# Altium project DWDM蝶形激光管驱动器.PrjPcb
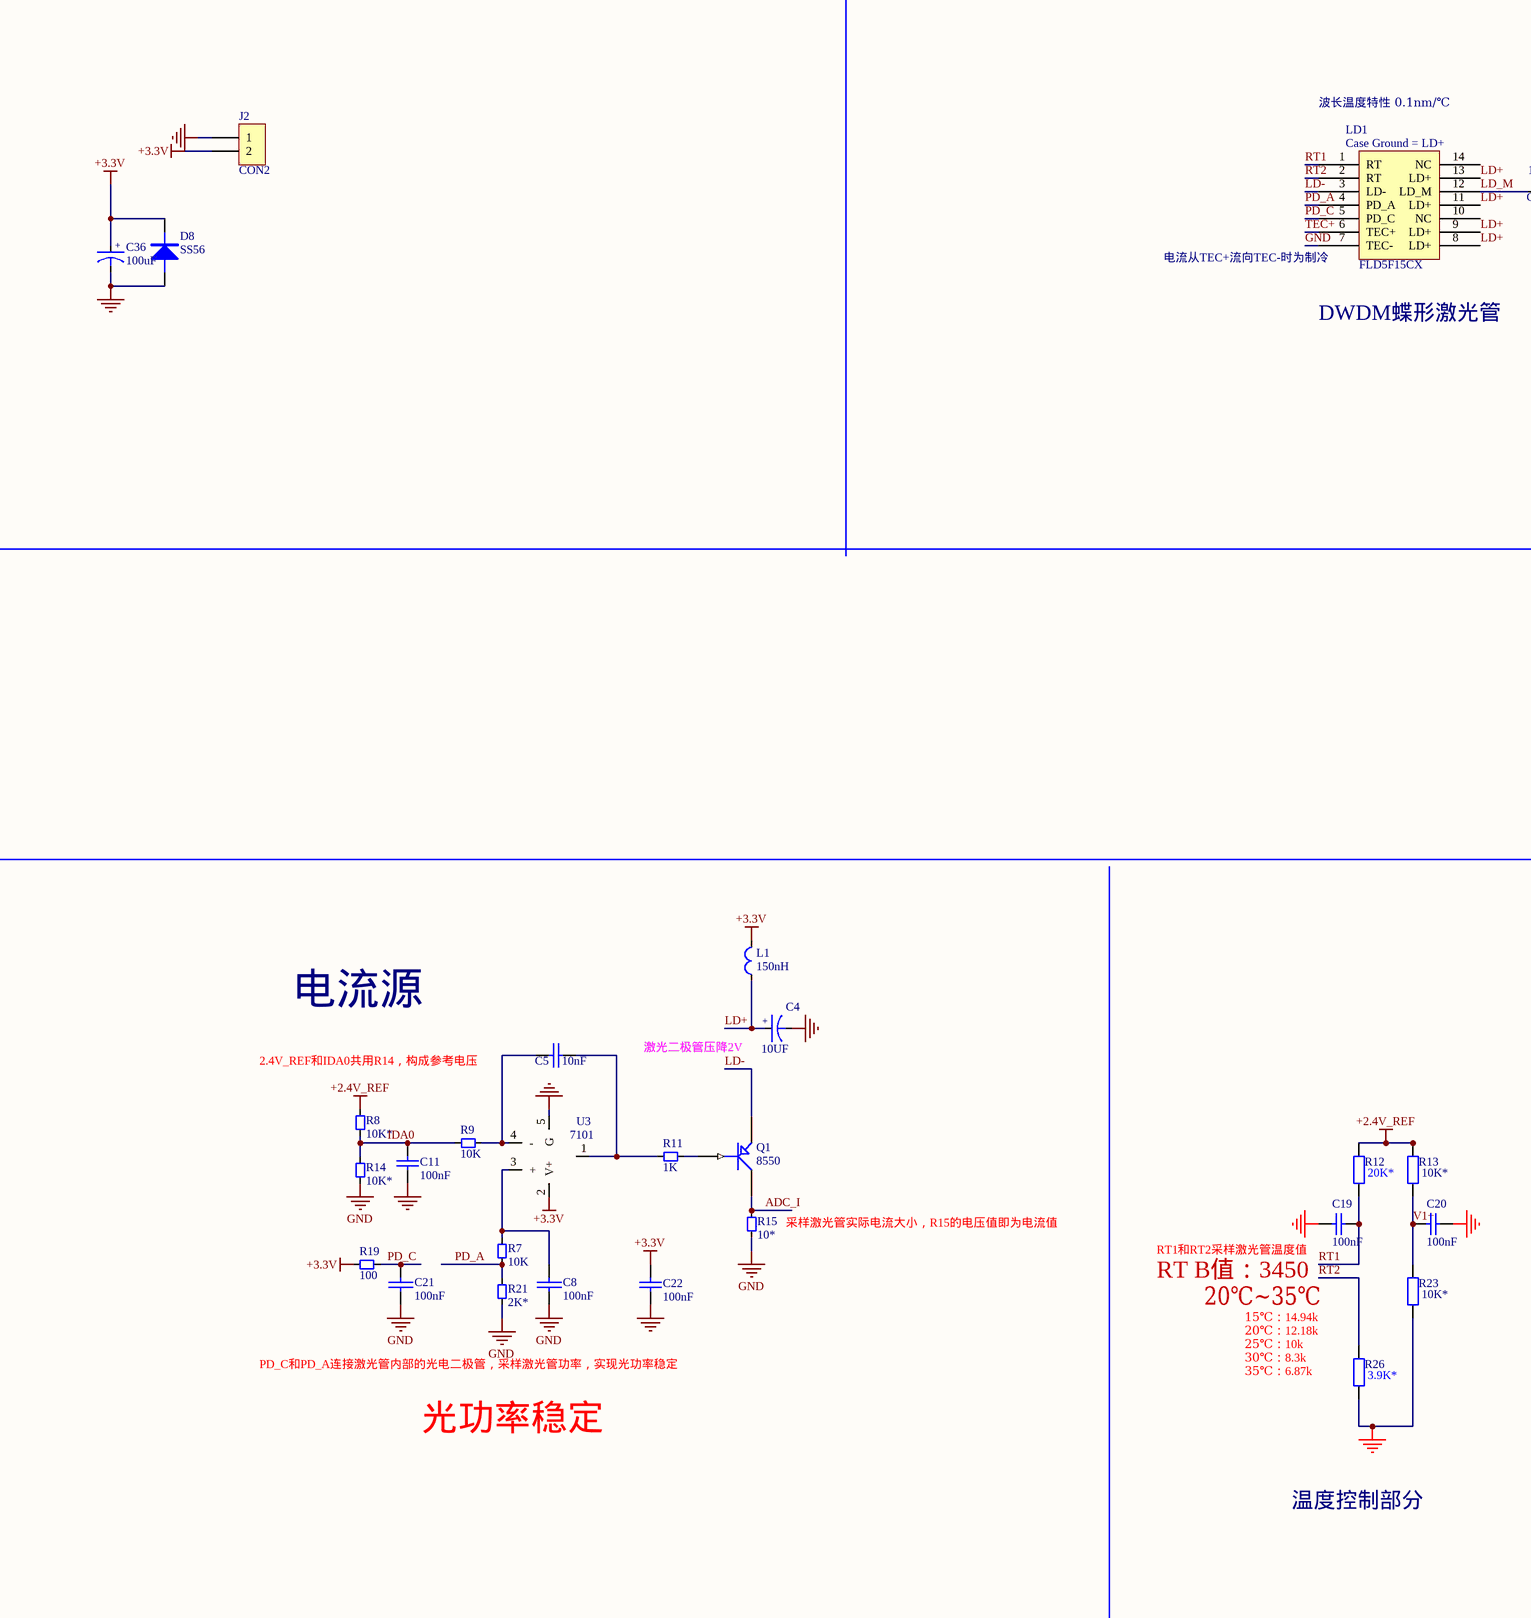
[diagram p0: DWDM蝶形激光管驱动器-线性.SchDoc, left]
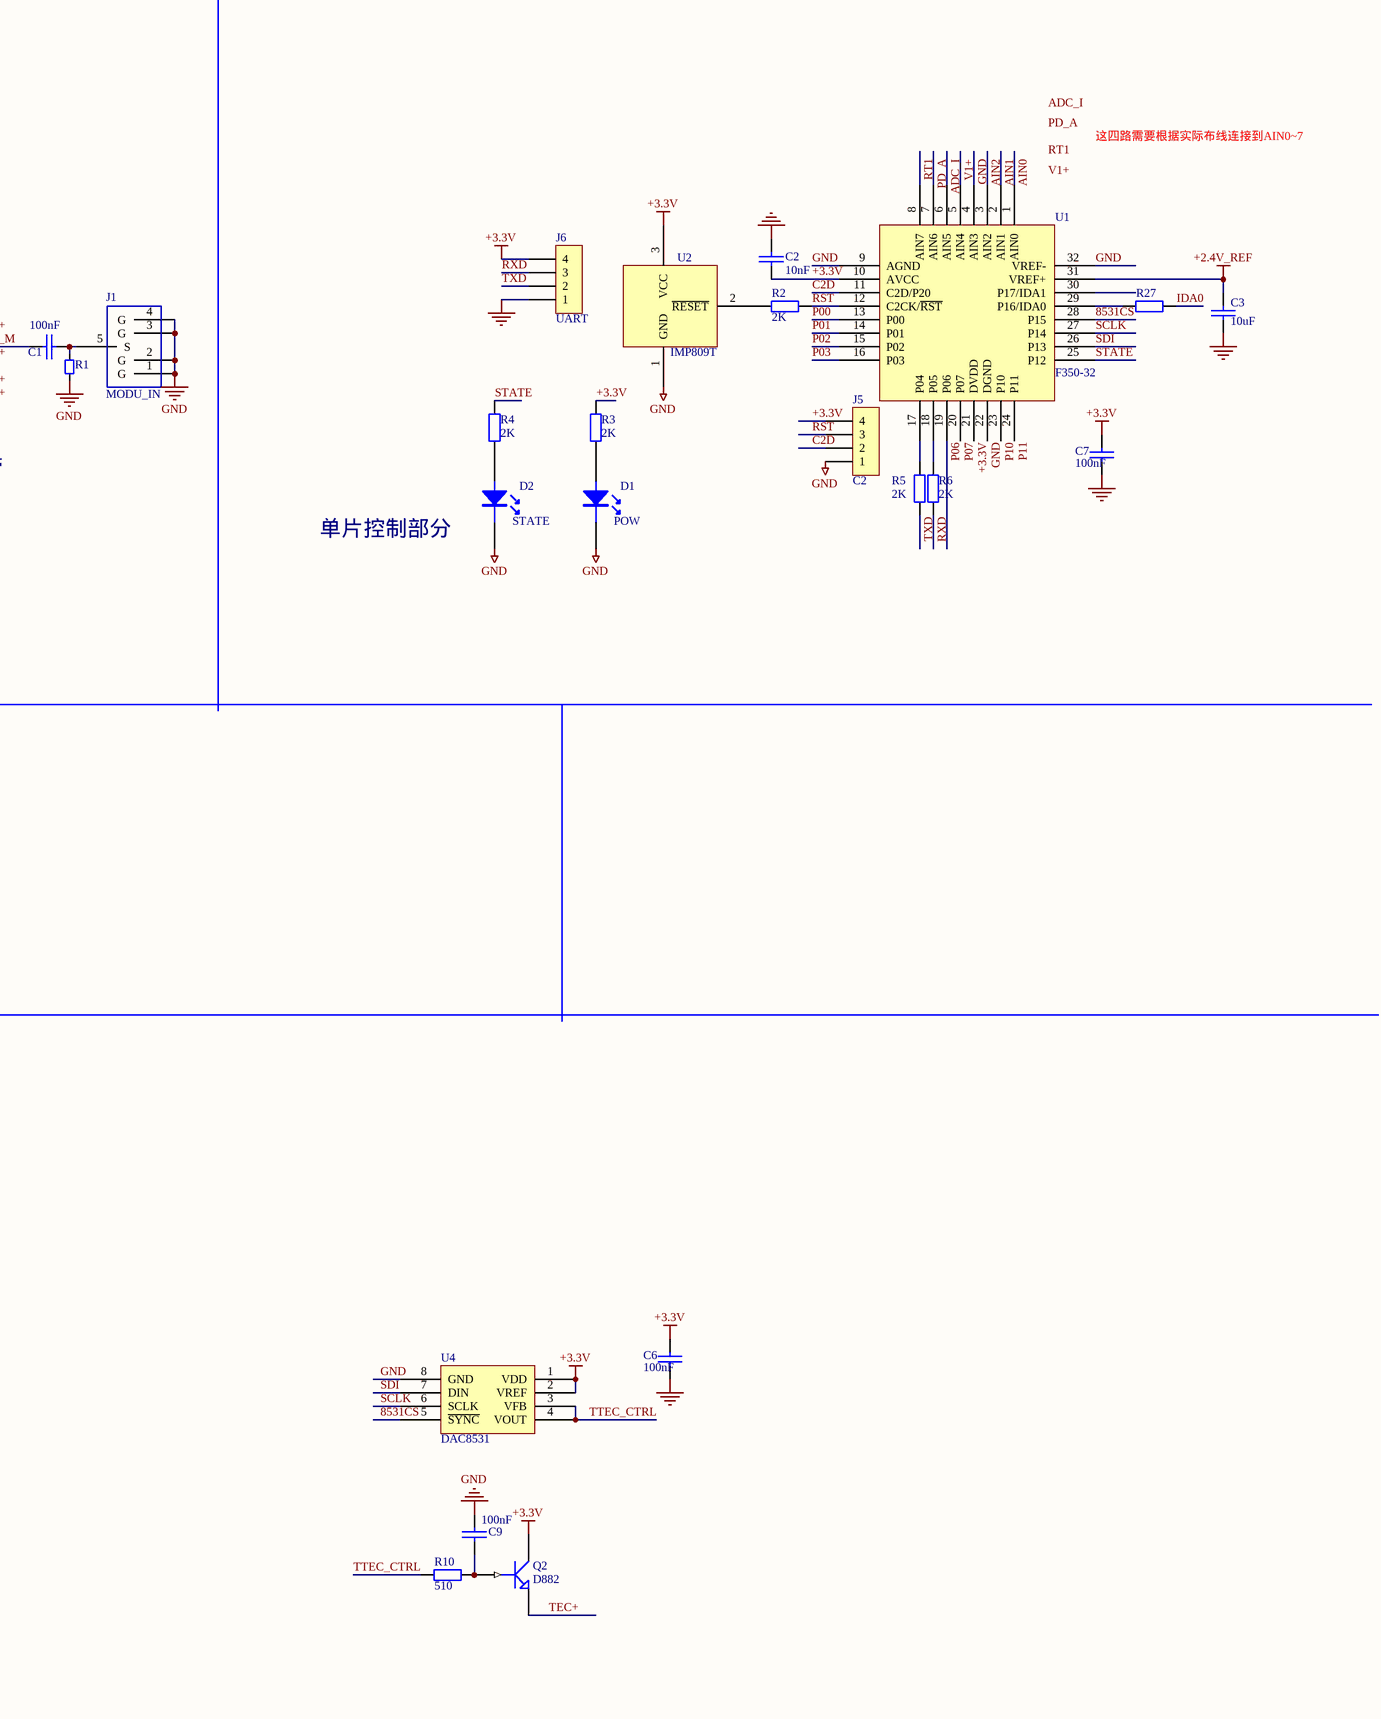
[diagram p1: DWDM蝶形激光管驱动器-线性.SchDoc, right]
1 sheet, 50 parts. Net scope: global (net labels, ports and power ports of the same name join across sheets).
Board file: DWDM激光驱动电路板-线性.PcbDoc

## Sheet DWDM蝶形激光管驱动器-线性.SchDoc
size A2

### Parts
C1  100nF  [0805]
C2  10nF  [0805]
C3  10uF  [0805]
C4  10UF  [1206-C]
C5  10nF  [0805]
C6  100nF  [0805]
C7  100nF  [0805]
C8  100nF  [0805]
C9  100nF  [0805]
C11  100nF  [0805]
C19  100nF  [0805]
C20  100nF  [0805]
C21  100nF  [0805]
C22  100nF  [0805]
C36  100uF  [C6032]
D1  POW  [LED.3]
D2  STATE  [LED.3]
D8  SS56  [1808D-]
J1  MODU_IN  [SMA]
J2  CON2  [JK2-394-F]
J5  C2  [SIP-4-Z]
J6  UART  [SIP-4-Z]
L1  150nH  [0805]
LD1  FLD5F15CX  [CM96/LC97-N]
Q1  8550  [SOT-23]
Q2  D882  [TO-252-D882]
R1  (no value)  [0805]
R2  2K  [0805]
R3  2K  [0805]
R4  2K  [0805]
R5  2K  [0805]
R6  2K  [0805]
R7  10K  [0805]
R8  10K*  [0805]
R9  10K  [0805]
R10  510  [0805]
R11  1K  [0805]
R12  20K*  [0805]
R13  10K*  [0805]
R14  10K*  [0805]
R15  10*  [0805]
R19  100  [0805]
R21  2K*  [0805]
R23  10K*  [0805]
R26  3.9K*  [0805]
R27  (no value)  [0805]
U1  F350-32  [LQFP32]
U2  IMP809T  [SOT-23-P]
U3  7101  [PDSO-G5-DBV]
U4  DAC8531  [PDSO-G8-DGK]

### Nets
+2.4V_REF: C3.1 R8.2 R12.2 R13.2 U1.31(VREF+)
+3.3V: C2.1 C6.1 C7.1 C22.2 C36.1 D8.2(Cathode) J2.2 J5.4 J6.4 L1.2 Q2.2(C) R3.2 R19.1 U1.10(AVCC) U1.21(DVDD) U2.3(VCC) U3.2(V+) U4.1(VDD) U4.2(VREF)
GND: C2.2 C3.2 C4.2 C6.2 C7.2 C8.1 C9.2 C11.1 C19.2 C20.2 C21.1 C22.1 C36.2 D1.2(K) D2.2(K) D8.1(Anode) J1.1(G) J1.2(G) J1.3(G) J1.4(G) J2.1 J5.1 J6.1 LD1.7(TEC-) R1.1 R14.1 R15.1 R21.1 R23.1 R26.1 U1.4(AIN3) U1.9(AGND) U1.22(DGND) U1.32(VREF-) U2.1(GND) U3.5(G) U4.8(GND)
8531CS: U1.28(P15) U4.5(~{SYNC})
ADC_I: Q1.3(C) R15.2 U1.6(AIN5)
AIN0: U1.1(AIN0)
AIN1: U1.2(AIN1)
AIN2: U1.3(AIN2)
C2D: J5.2 U1.11(C2D/P20)
IDA0: C11.2 R8.1 R9.2 R14.2 R27.1
LD+: C4.1 L1.1 LD1.8(LD+) LD1.9(LD+) LD1.11(LD+) LD1.13(LD+)
LD-: LD1.3(LD-) Q1.2(E)
LD_M: C1.1 LD1.12(LD_M)
P00: U1.13(P00)
P01: U1.14(P01)
P02: U1.15(P02)
P03: U1.16(P03)
P06: U1.19(P06)
P07: U1.20(P07)
P10: U1.23(P10)
P11: U1.24(P11)
PD_A: LD1.4(PD_A) R7.2 R21.2 U1.7(AIN6)
PD_C: C21.2 LD1.5(PD_C) R19.2
RST: J5.3 R2.1 U1.12(C2CK/~{RST})
RT1: C19.1 LD1.1(RT) R12.1 U1.8(AIN7)
RT2: LD1.2(RT) R26.2
RXD: J6.3 R6.1
SCLK: U1.27(P14) U4.6(SCLK)
SDI: U1.26(P13) U4.7(DIN)
STATE: R4.2 U1.25(P12)
TEC+: LD1.6(TEC+) Q2.1(E)
TTEC_CTRL: R10.2 U4.3(VFB) U4.4(VOUT)
TXD: J6.2 R5.1
V1+: C20.1 R13.1 R23.2 U1.5(AIN4)
NetC1_2: C1.2 J1.5(S) R1.2
NetC5_1: C5.1 R9.1 U3.4(-)
NetC5_2: C5.2 R11.1 U3.1
NetC8_2: C8.2 R7.1 U3.3(+)
NetC9_1: C9.1 Q2.3(B) R10.1
NetD1_1: D1.1(A) R3.1
NetD2_1: D2.1(A) R4.1
NetQ1_1: Q1.1(B) R11.2
NetR2_2: R2.2 U2.2(~{RESET})
NetR5_2: R5.2 U1.17(P04)
NetR6_2: R6.2 U1.18(P05)
NetR27_2: R27.2 U1.29(P16/IDA0)

Not connected (* = marked no-connect by the designer): LD1 10(NC) 14(NC); U1 30(P17/IDA1)

### Notes on the sheet
- 这四路需要根据实际布线连接到AIN0~7
- 波长温度特性 0.1nm/℃
- 电流从TEC+流向TEC-时为制冷
- DWDM蝶形激光管
- 单片控制部分
- (near R8) 2.4V_REF和IDA0共用R14，构成参考电压
- 电流源
- 激光二极管压降2V
- (near R15) 采样激光管实际电流大小，R15的电压值即为电流值
- RT1和RT2采样激光管温度值
- RT B值：3450
- 20℃~35℃
- 20℃：12.18k
- 15℃：14.94k
- PD_C和PD_A连接激光管内部的光电二极管，采样激光管功率，实现光功率稳定
- 25℃：10k
- 35℃：6.87k
- 30℃：8.3k
- 光功率稳定
- 温度控制部分
- Labels drawn without touching a wire or pin: ADC_I, PD_A, RT1, V1+
- (in symbol CAP-POL-TA) +
- (in symbol FLD5F15CX) Case Ground = LD+

### Library data of the parts
C1-C3 C5-C9 C21 = CAP: Capacitor
C4 C36 = CAP-POL-TA
C11 C22 = Cap: Capacitor; Part Field 10: 9; Part Field 1: 08/06/2000; Part Field 2: Altium Hobart Technology Centre; Part Field 3: Generic Components; Part Field 4: Passive; Part Field 5: Capacitor; Part Field 6: 100nF; Part Field 9: 9; Part Field 11: 9; Part Field 12: 9; Part Field 13: 9; Part Field 14: 9; Part Field 15: 9; Part Field 16: 9
C19 C20 = Cap: Capacitor; Part Field 10: 1; Part Field 1: 08/06/2000; Part Field 2: Altium Hobart Technology Centre; Part Field 3: Generic Components; Part Field 4: Passive; Part Field 5: Capacitor; Part Field 6: 100nF; Part Field 9: 1; Part Field 11: 1; Part Field 12: 1; Part Field 13: 1; Part Field 14: 1; Part Field 15: 1; Part Field 16: 1
D1 D2 = LED
D8 = DIODE
J1 = SMA
J2 = CON2: Connector
J5 J6 = CON4: Connector
L1 = INDUCTOR
Q1 = PNP-SOT23
Q2 = NPN-TO252
R1 R7-R9 R11 R14 R15 R19 R21 = RES
R2-R6 R10 R27 = RES2
R12 R13 R23 R26 = Res2: Resistor; Part Field 1: 08/06/2000; Part Field 2: Altium Hobart Technology Centre; Part Field 3: Generic Components; Part Field 4: Passive; Part Field 5: Resistor
  R12 R13: Part Field 6: 10K
  R23 R26: Part Field 6: 4.7K
U1 = C8051F350-32
U2 = IMP809
U3 = LMC7101